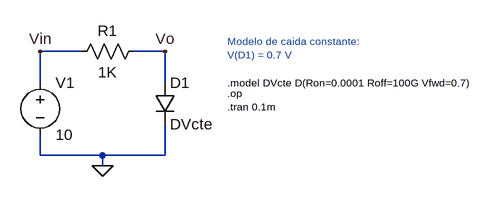
[diagram p0: schematic ejemplo_caida-constante.asc]
ejemplo_caida-constante.asc, the LTspice schematic file:
Version 4
SHEET 1 1376 680
WIRE -80 32 -144 32
WIRE 48 32 0 32
WIRE -144 80 -144 32
WIRE 48 80 48 32
WIRE -144 192 -144 160
WIRE -48 192 -144 192
WIRE 48 192 48 144
WIRE 48 192 -48 192
WIRE -48 208 -48 192
FLAG -48 208 0
FLAG 48 32 Vo
FLAG -144 32 Vin
SYMBOL diode 32 80 R0
SYMATTR InstName D1
SYMATTR Value DVcte
SYMBOL voltage -144 64 R0
WINDOW 123 0 0 Left 0
WINDOW 39 0 0 Left 0
SYMATTR InstName V1
SYMATTR Value 10
SYMBOL res 16 16 R90
WINDOW 0 0 56 VBottom 2
WINDOW 3 32 56 VTop 2
SYMATTR InstName R1
SYMATTR Value 1K
TEXT 144 96 Left 1 !.op\n.tran 0.1m
TEXT 144 80 Left 1 !.model DVcte D(Ron=0.0001 Roff=100G Vfwd=0.7)
TEXT 144 16 Left 1 ;Modelo de caida constante:\nV(D1) = 0.7 V

The netlist it stands for:
* ejemplo_caida-constante.asc
D1 Vo 0 DVcte
V1 Vin 0 10
R1 Vo Vin 1K
.model D D
.lib standard.dio
.op
.tran 0.1m
.model DVcte D(Ron=0.0001 Roff=100G Vfwd=0.7)
* Modelo de caida constante:
* V(D1) = 0.7 V
.backanno
.end